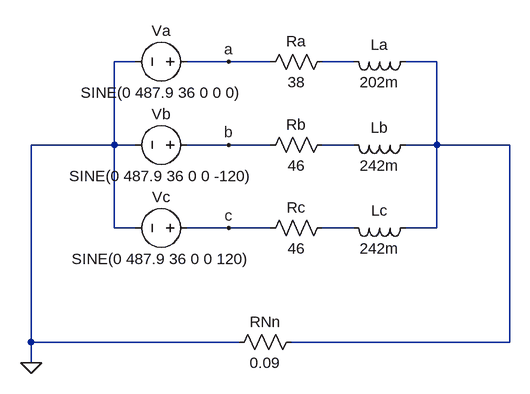
[diagram p0: schematic Star-star3.asc]
Star-star3.asc, the LTspice schematic file:
Version 4
SHEET 1 880 680
WIRE 112 -64 80 -64
WIRE 256 -64 192 -64
WIRE 320 -64 256 -64
WIRE 448 -64 400 -64
WIRE 576 -64 528 -64
WIRE 80 64 80 -64
WIRE 80 64 -48 64
WIRE 112 64 80 64
WIRE 256 64 192 64
WIRE 320 64 256 64
WIRE 448 64 400 64
WIRE 576 64 576 -64
WIRE 576 64 528 64
WIRE 688 64 576 64
WIRE 80 192 80 64
WIRE 112 192 80 192
WIRE 256 192 192 192
WIRE 320 192 256 192
WIRE 448 192 400 192
WIRE 576 192 576 64
WIRE 576 192 528 192
WIRE -48 368 -48 64
WIRE 272 368 -48 368
WIRE 688 368 688 64
WIRE 688 368 352 368
WIRE -48 400 -48 368
FLAG 256 -64 a
FLAG 256 64 b
FLAG 256 192 c
FLAG -48 400 0
SYMBOL voltage 208 -64 R90
WINDOW 0 -32 56 VBottom 2
WINDOW 3 32 56 VTop 2
WINDOW 123 0 0 Left 0
WINDOW 39 0 0 Left 0
SYMATTR InstName Va
SYMATTR Value SINE(0 487.9 36 0 0 0)
SYMBOL voltage 208 64 R90
WINDOW 0 -32 56 VBottom 2
WINDOW 3 32 56 VTop 2
WINDOW 123 0 0 Left 0
WINDOW 39 0 0 Left 0
SYMATTR InstName Vb
SYMATTR Value SINE(0 487.9 36 0 0 -120)
SYMBOL voltage 208 192 R90
WINDOW 0 -32 56 VBottom 2
WINDOW 3 32 56 VTop 2
WINDOW 123 0 0 Left 0
WINDOW 39 0 0 Left 0
SYMATTR InstName Vc
SYMATTR Value SINE(0 487.9 36 0 0 120)
SYMBOL res 416 -80 R90
WINDOW 0 0 56 VBottom 2
WINDOW 3 32 56 VTop 2
SYMATTR InstName Ra
SYMATTR Value 38
SYMBOL res 416 48 R90
WINDOW 0 0 56 VBottom 2
WINDOW 3 32 56 VTop 2
SYMATTR InstName Rb
SYMATTR Value 46
SYMBOL res 416 176 R90
WINDOW 0 0 56 VBottom 2
WINDOW 3 32 56 VTop 2
SYMATTR InstName Rc
SYMATTR Value 46
SYMBOL ind 544 -80 R90
WINDOW 0 5 56 VBottom 2
WINDOW 3 32 56 VTop 2
SYMATTR InstName La
SYMATTR Value 202m
SYMBOL ind 544 48 R90
WINDOW 0 5 56 VBottom 2
WINDOW 3 32 56 VTop 2
SYMATTR InstName Lb
SYMATTR Value 242m
SYMBOL ind 544 176 R90
WINDOW 0 5 56 VBottom 2
WINDOW 3 32 56 VTop 2
SYMATTR InstName Lc
SYMATTR Value 242m
SYMBOL res 368 352 R90
WINDOW 0 0 56 VBottom 2
WINDOW 3 32 56 VTop 2
SYMATTR InstName RNn
SYMATTR Value 0.09

The netlist it stands for:
* Star-star3.asc
Va a 0 SINE(0 487.9 36 0 0 0)
Vb b 0 SINE(0 487.9 36 0 0 -120)
Vc c 0 SINE(0 487.9 36 0 0 120)
Ra N001 a 38
Rb N003 b 46
Rc N004 c 46
La N002 N001 202m
Lb N002 N003 242m
Lc N002 N004 242m
RNn N002 0 0.09
.backanno
.end